# Altium schematic sheet ERF1KM151G20OT1_ERF1KM151G20OT.schdoc
size 124 x 101 mm
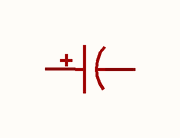
[diagram p0: ERF1KM151G20OT1_ERF1KM151G20OT.schdoc]

## Parts
C?  150uF  [CAP-TH_BD10.0-P5.00-D1.0-FD]  (value not drawn)

## Nets

Not connected (* = marked no-connect by the designer): C? 1 2

## Library data of the parts
C? = ERF1KM151G20OT: Manufacturer: AISHI(艾华集团); Add into BOM: yes; Tolerance: ±20%; Rated Voltage: 100V; φD: 10mm; L: 20mm; Lifetime @ Temp: 5000hrs@105℃; Symbol: ERF1KM151G20OT; Device: ERF1KM151G20OT; LCSC Part Name: 150uF ±20% 100V; Supplier Part: C106544; Manufacturer Part: ERF1KM151G20OT; Supplier Footprint: 插件,D10xL20mm; JLCPCB Part Class: Extended Part; Datasheet: https://atta.szlcsc.com/upload/public/pdf/source/20190702/C401585_ECDCA01C06D0A8ADC16AC29A8A7D8A63.pdf; Supplier: LCSC; Convert to PCB: yes; Value: 150uF; Ripple Current: -; Equivalent Series Resistance(ESR): -; Lead Spacing: 5mm